# EAGLE board MainECU rev14 (EAGLE 9.6.2), part 1 of 2
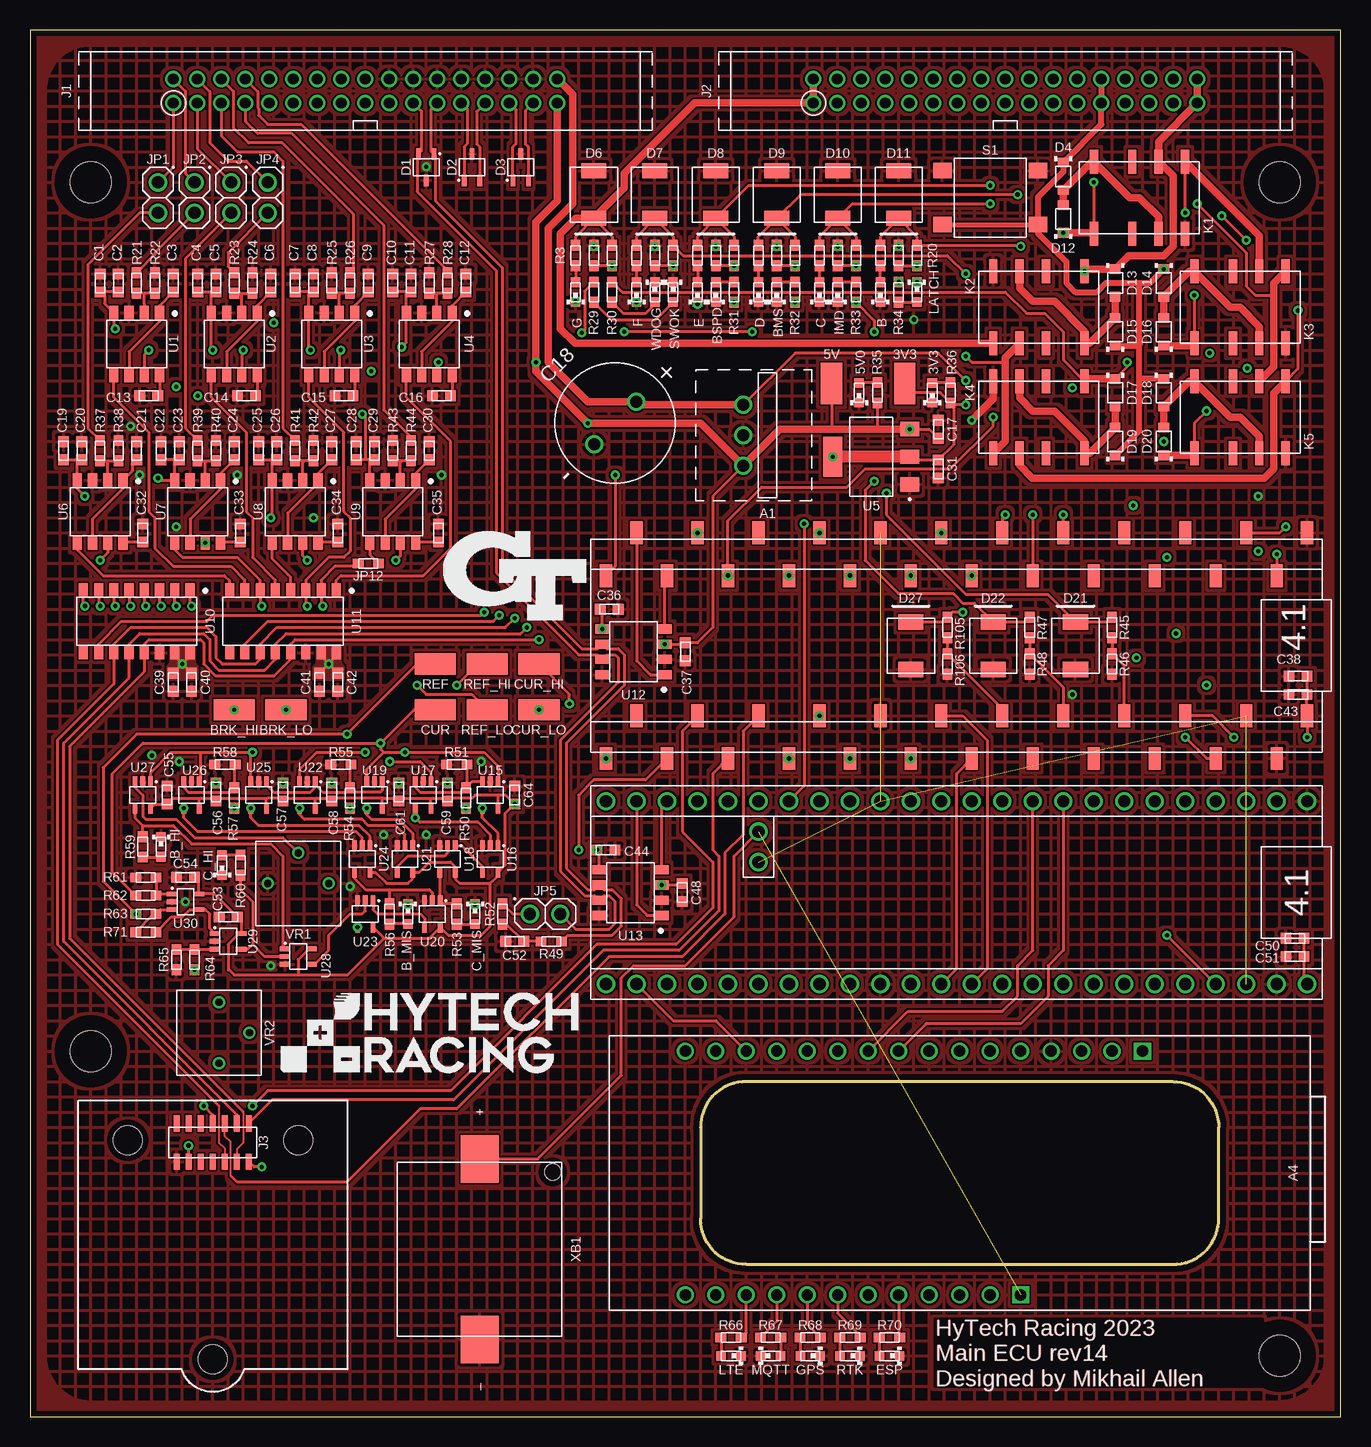
[diagram p8: board, top side]
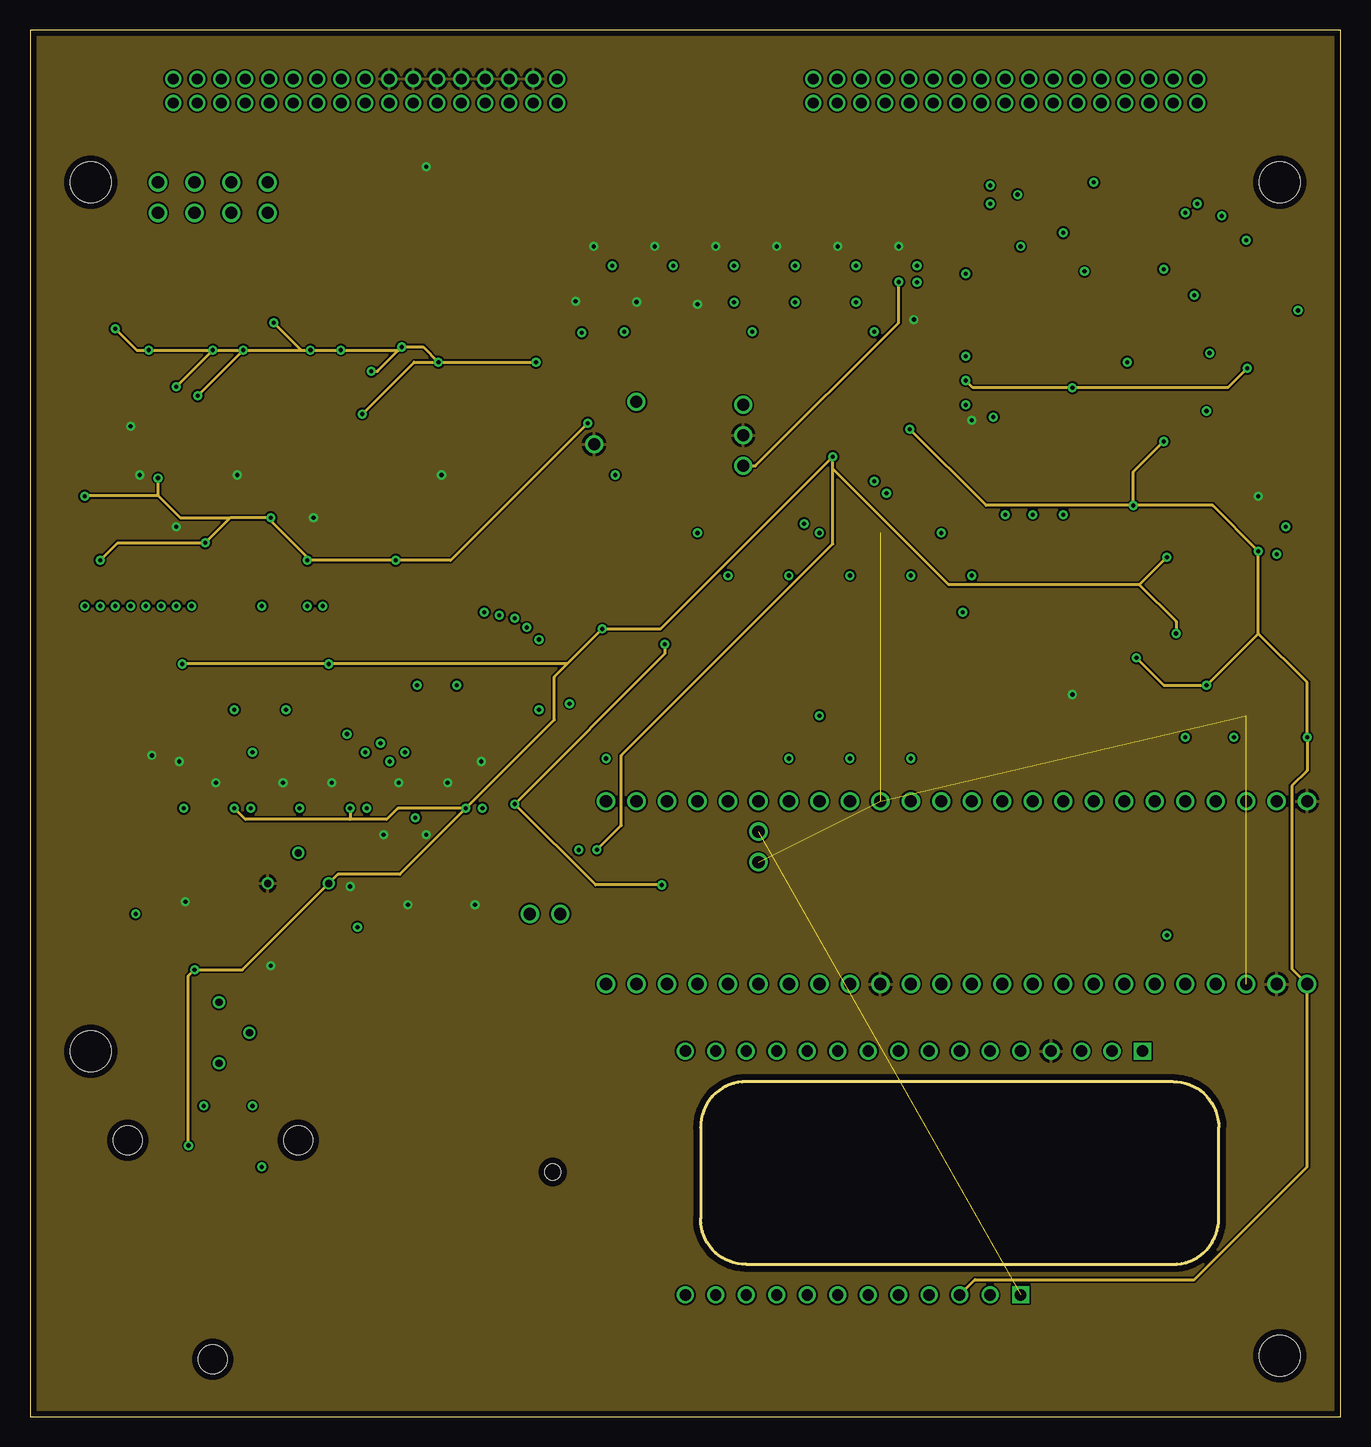
[diagram p9: board, inner layer Route2]
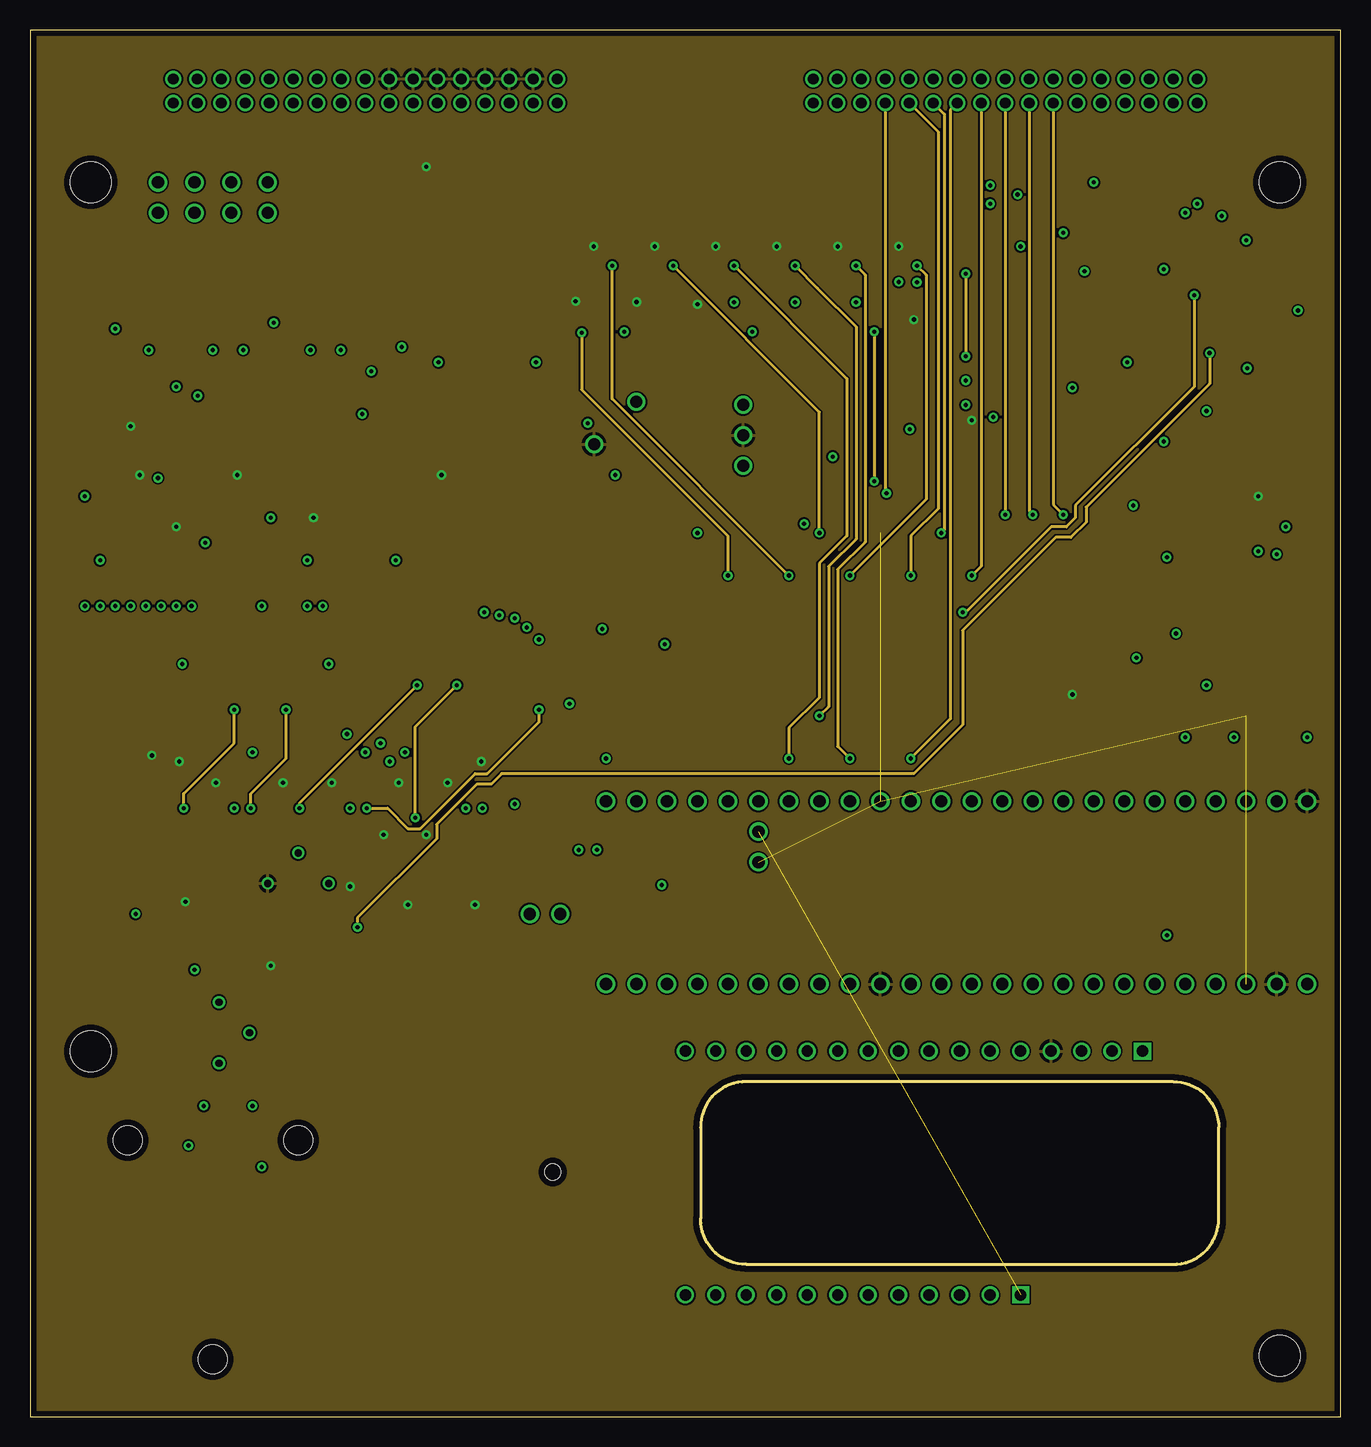
[diagram p10: board, inner layer Route15]
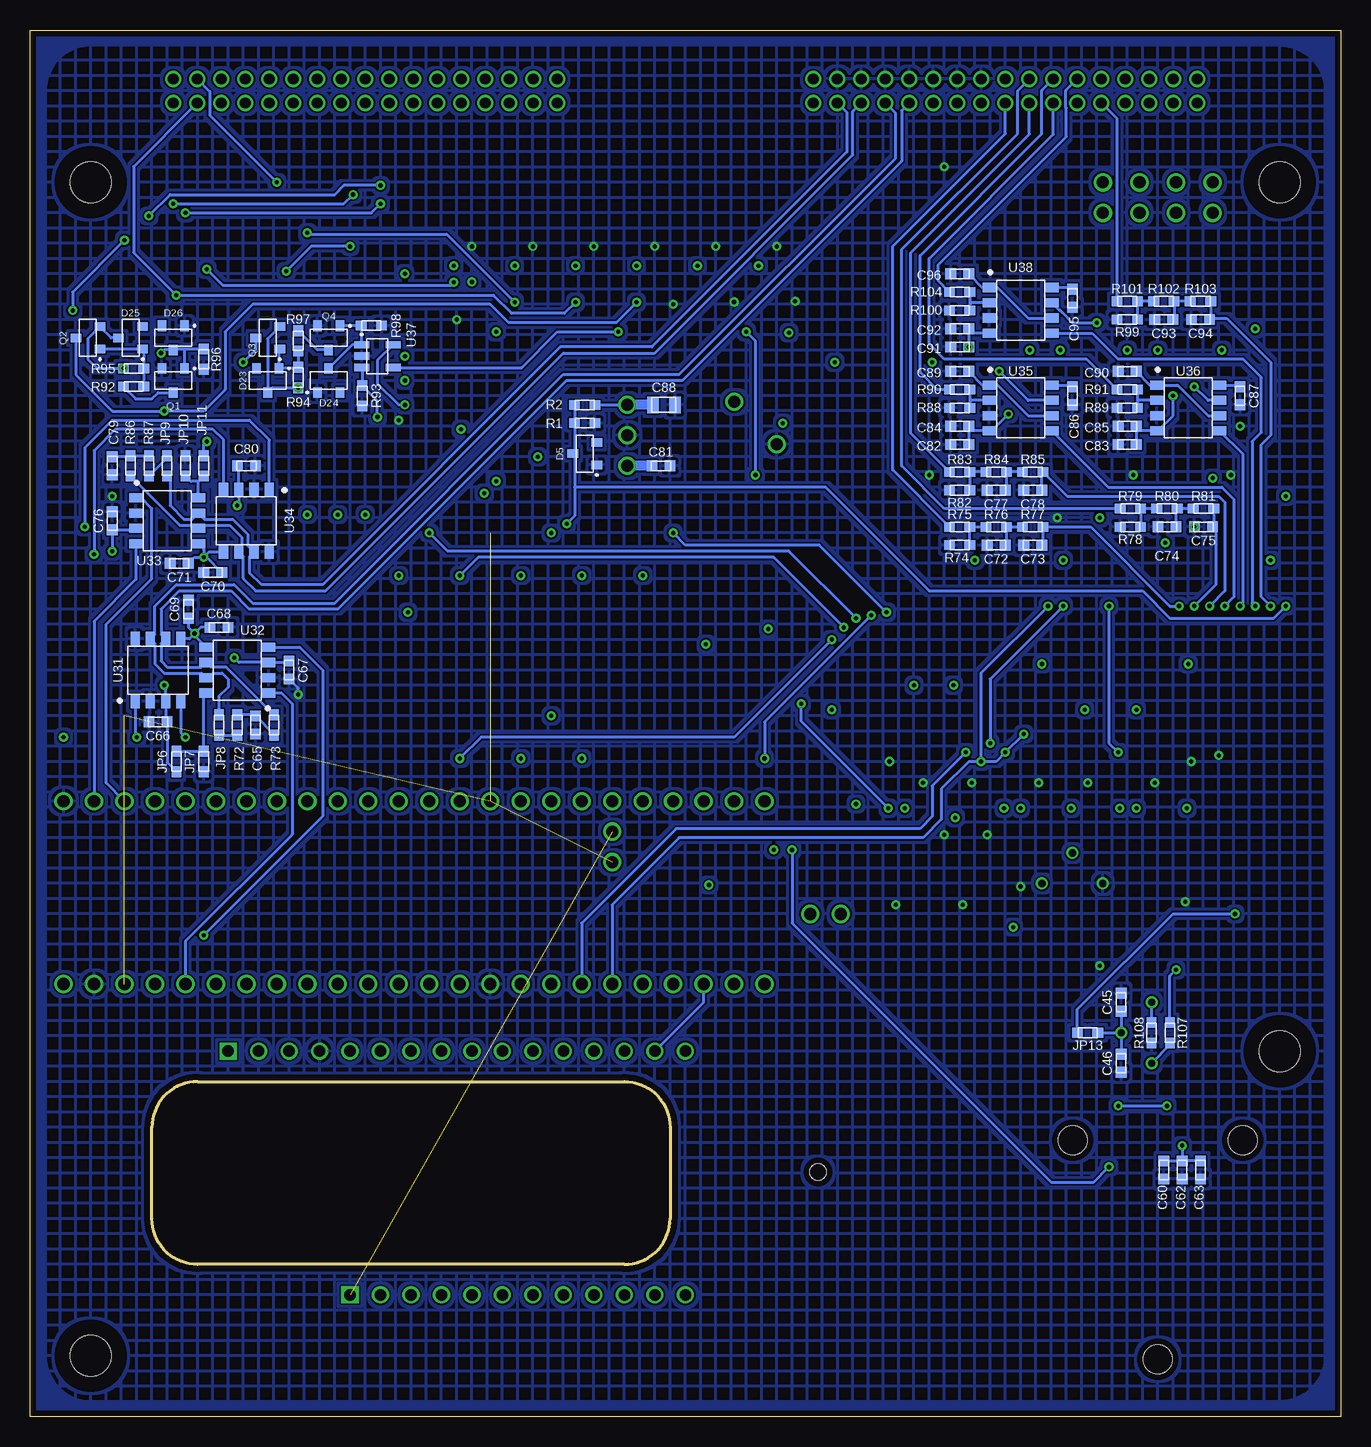
[diagram p11: board, bottom side, seen from below]

Size 109.22 x 115.57 mm. Coordinates in mm from the lower left corner, seen from the top.
Outline: 0,0 109.22,0 109.22,115.57 0,115.57 0,0
Outline: 55.88,24.13 55.88,16.51 arc90 59.69,12.7 95.25,12.7 arc90 99.06,16.51 99.06,24.13 arc90 95.25,27.94 59.69,27.94 arc90 55.88,24.13
Copper layers (1+2*15+16): Top 0.035mm / dielectric 0.2mm / Route2 0.0175mm / dielectric 1.065mm / Route15 0.0175mm / dielectric 0.2mm / Bottom 0.035mm
Design rules "HyTech Default (4 Layer)": minimum track width 6mil, minimum drill 10mil, track to track 6mil, track to pad 6mil, pad to pad 6mil, via to via 20mil, smd to smd 6mil, copper to edge 20mil, drill to drill 21mil, minimum pad ring 8mil, minimum via ring 8mil, stop-mask expansion 3mil, vias tented up to drill 30mil, thermal gap 10mil

## Footprints (pad centres in the part's own frame; a part is rotated, then mirrored left to right if it is on the bottom)
0603-LED = smd 0.8 x 0.8: 1 -0.825,0; 2 0.825,0
MOUNTING_M3 = hole 3.4: 0,0
OKI-78SR = drill 0.991: 1 -2.54,0; 2 0,0; 3 2.54,0
TEENSY_LONG_SSM = smd 1.905 x 1.02: 3.3V -5.842,-24.13; 3.3V@1 9.398,6.35; AGND/GND -9.398,-26.67; D0 5.842,-26.67; D1 9.398,-24.13; D2 5.842,-21.59; D3 9.398,-19.05; D4 5.842,-16.51; D5 9.398,-13.97; D6 5.842,-11.43; D7 9.398,-8.89; D8 5.842,-6.35; D9 9.398,-3.81; D10 5.842,-1.27; D11 9.398,1.27; D12 5.842,3.81; D13 -9.398,3.81; D14 -5.842,1.27; D15 -9.398,-1.27; D16 -5.842,-3.81; D17 -9.398,-6.35; D18 -5.842,-8.89; D19 -9.398,-11.43; D20 -5.842,-13.97; D21 -9.398,-16.51; D22 -5.842,-19.05; D23 -9.398,-21.59; D24 5.842,8.89; D25 9.398,11.43; D26 5.842,13.97; D27 9.398,16.51; D28 5.842,19.05; D29 9.398,21.59; D30 5.842,24.13; D31 9.398,26.67; D32 5.842,29.21; D33 -9.398,29.21; D34 -5.842,26.67; D35 -9.398,24.13; D36 -5.842,21.59; D37 -9.398,19.05; D38 -5.842,16.51; D39 -9.398,13.97; D40 -5.842,11.43; D41 -9.398,8.89; GND 9.398,-29.21; GND@1 -5.842,6.35; VIN -5.842,-29.21
TEENSY_LONG_EXT = drill 1.016: 3V3 0,5.08; 3V3@2 15.24,35.56; 3V3@3 10.16,45.72; AGND/GND 0,2.54; D0 15.24,2.54; D1 15.24,5.08; D2 15.24,7.62; D3 15.24,10.16; D4 15.24,12.7; D5 15.24,15.24; D6 15.24,17.78; D7 15.24,20.32; D8 15.24,22.86; D9 15.24,25.4; D10 15.24,27.94; D11 15.24,30.48; D12 15.24,33.02; D13 0,33.02; D14 0,30.48; D15 0,27.94; D16 0,25.4; D17 0,22.86; D18 0,20.32; D19 0,17.78; D20 0,15.24; D21 0,12.7; D22 0,10.16; D23 0,7.62; D24 15.24,38.1; D25 15.24,40.64; D26 15.24,43.18; D27 15.24,45.72; D28 15.24,48.26; D29 15.24,50.8; D30 15.24,53.34; D31 15.24,55.88; D32 15.24,58.42; D33 0,58.42; D34 0,55.88; D35 0,53.34; D36 0,50.8; D37 0,48.26; D38 0,45.72; D39 0,43.18; D40 0,40.64; D41 0,38.1; GND 15.24,0; GND@2 0,35.56; VBAT 12.7,45.72; VIN 0,0
NRF9160LTE = drill 0.95: 2 -10.16,46.99; 3 -10.16,44.45; 3V3 10.16,16.51; 4 -10.16,41.91; 5 -10.16,39.37; 6 -10.16,36.83; 7 -10.16,34.29; 8 -10.16,31.75; A0 10.16,24.13; A1 10.16,26.67; A2 10.16,29.21; A3 10.16,31.75; A4 10.16,34.29; A5 10.16,36.83; CIPO 10.16,44.45; COPI 10.16,41.91; EN -10.16,26.67; GND 10.16,21.59; MD 10.16,19.05; PS-EN 10.16,52.07; RX 10.16,46.99; SCK 10.16,39.37; SCL/1 -10.16,49.53; SDA/0 -10.16,52.07; TX 10.16,49.53; VUSB -10.16,29.21 | drill 0.95 square: RESET 10.16,13.97; VBAT -10.16,24.13
0603-CAP = smd 0.9 x 0.9: 1 -0.75,0; 2 0.75,0
EEH-AZS = drill 1: MINUS 2.5,0; PLUS -2.5,0
0805-CAP = smd 0.95 x 1.4: 1 -0.925,0; 2 0.925,0
SC-70-3 = smd 0.95 x 0.4: 1 -1.1,0.65; 2 -1.1,-0.65; 3 1.1,0
SOD-323 = smd 0.8 x 0.9: A -1.15,0; C 1.15,0
SOT-23 = smd 0.711 x 0.889: 1 -0.94,-1.003; 2 0.94,-1.003; 3 0,1.003
DO-214AA = smd 1.27 x 2.1: 1 -1.98,0; 2 1.98,0
EHT-117-01 = drill 0.9: 1 -16,-1; 2 -16,1; 3 -14,-1; 4 -14,1; 5 -12,-1; 6 -12,1; 7 -10,-1; 8 -10,1; 9 -8,-1; 10 -8,1; 11 -6,-1; 12 -6,1; 13 -4,-1; 14 -4,1; 15 -2,-1; 16 -2,1; 17 0,-1; 18 0,1; 19 2,-1; 20 2,1; 21 4,-1; 22 4,1; 23 6,-1; 24 6,1; 25 8,-1; 26 8,1; 27 10,-1; 28 10,1; 29 12,-1; 30 12,1; 31 14,-1; 32 14,1; 33 16,-1; 34 16,1
ADIS16460 = smd 0.5 x 1.37: 1 -3,1.6; 2 -3,-1.6; 3 -2,1.6; 4 -2,-1.6; 5 -1,1.6; 6 -1,-1.6; 7 0,1.6; 8 0,-1.6; 9 1,1.6; 10 1,-1.6; 11 2,1.6; 12 2,-1.6; 13 3,1.6; 14 3,-1.6 | hole 2.4: -7.1,-0.19; 7.1,-0.19; 0,18.06
1X02 = drill 1.016: 1 -1.27,0; 2 1.27,0
0603-RES = smd 0.9 x 0.8: 1 -0.85,0; 2 0.85,0
IM*G = smd 0.7 x 2: 1 -3.8,-3; 2 -0.6,-3; 3 1.6,-3; 4 3.8,-3; 5 3.8,3; 6 1.6,3; 7 -0.6,3; 8 -3.8,3
B3S-100X = smd 1.55 x 1.3: 1 3.975,-2.25; 2 -3.975,-2.25; 3 3.975,2.25; 4 -3.975,2.25
5015 = smd 3.429 x 1.778: 1 0,0
SOIC-08(NARROW,0.15") = smd 0.762 x 1.143: 1 -1.905,-2.603; 2 -0.635,-2.603; 3 0.635,-2.603; 4 1.905,-2.603; 5 1.905,2.603; 6 0.635,2.603; 7 -0.635,2.603; 8 -1.905,2.603
SOT-223 = smd 1.2 x 1.6: 1 -2.3,-3.2; 2 0,-3.2; 3 2.3,-3.2 | smd 3.3 x 1.6: 4 0,3.2
SOIC-16 = smd 0.762 x 1.143: 1 -4.445,-2.603; 2 -3.175,-2.603; 3 -1.905,-2.603; 4 -0.635,-2.603; 5 0.635,-2.603; 6 1.905,-2.603; 7 3.175,-2.603; 8 4.445,-2.603; 9 4.445,2.603; 10 3.175,2.603; 11 1.905,2.603; 12 0.635,2.603; 13 -0.635,2.603; 14 -1.905,2.603; 15 -3.175,2.603; 16 -4.445,2.603
SC-70-5 = smd 0.4 x 0.9: 1 -0.65,-1.1; 2 0,-1.1; 3 0.65,-1.1; 4 0.65,1.1; 5 -0.65,1.1
SOT-23-5 = smd 0.62 x 1.22: 1 -0.95,-1.31; 2 0,-1.31; 3 0.95,-1.31; 4 0.95,1.31; 5 -0.95,1.31
3362P = drill 0.6: 1 -2.54,0; 2 0,2.54; 3 2.54,0
498 = smd 3.962 x 3.175: 1 -7.518,0; 2 7.518,0 | hole 1.346: -6.426,6.096

## Placement (x,y rotation side)
3V3  LED_0603_YELLOW  [0603-LED]  75.18,85.34 90 top
5V0  LED_0603_YELLOW  [0603-LED]  69.09,85.34 90 top
$$U$1  [LOGO_GT_MEDIUM]  40.39,70.1 0 top
$$U$2  [MOUNTING_M3]  5.08,102.87 0 top
$$U$6  [MOUNTING_M3]  104.14,5.08 0 top
A1  VOLTAGE_REGULATOR_MODULE_OKI-78SR_5V  [OKI-78SR]  59.44,81.79 270 top
A2  TEENSY_4.1_SMT  [TEENSY_LONG_SSM]  77.22,64.26 90 top
A3  TEENSY_4.1  [TEENSY_LONG_EXT]  106.43,36.07 90 top
A4  NRF9160LTE  [NRF9160LTE]  106.68,20.32 90 top
B  LED_0603_GREEN  [0603-LED]  70.87,93.73 90 top
B_HI  LED_0603_RED  [0603-LED]  10.92,47.5 270 top
B_MIS  LED_0603_RED  [0603-LED]  31.5,41.91 270 top
BMS  LED_0603_ORANGE  [0603-LED]  62.23,93.73 90 top
BSPD  LED_0603_GREEN  [0603-LED]  57.15,93.73 90 top
C  LED_0603_GREEN  [0603-LED]  65.79,93.73 90 top
C1  CAPACITOR_0603_10V_0.1UF  [0603-CAP]  5.84,94.49 90 top
C2  CAPACITOR_0603_10V_1UF  [0603-CAP]  7.37,94.49 90 top
C3  CAPACITOR_0603_10V_0.1UF  [0603-CAP]  11.94,94.49 90 top
C4  CAPACITOR_0603_10V_0.1UF  [0603-CAP]  13.97,94.49 90 top
C5  CAPACITOR_0603_10V_1UF  [0603-CAP]  15.49,94.49 90 top
C6  CAPACITOR_0603_10V_0.1UF  [0603-CAP]  20.07,94.49 90 top
C7  CAPACITOR_0603_10V_0.1UF  [0603-CAP]  22.1,94.49 90 top
C8  CAPACITOR_0603_10V_1UF  [0603-CAP]  23.62,94.49 90 top
C9  CAPACITOR_0603_10V_0.1UF  [0603-CAP]  28.19,94.49 90 top
C10  CAPACITOR_0603_10V_0.1UF  [0603-CAP]  30.23,94.49 90 top
C11  CAPACITOR_0603_10V_1UF  [0603-CAP]  31.75,94.49 90 top
C12  CAPACITOR_0603_10V_0.1UF  [0603-CAP]  36.32,94.49 90 top
C13  CAPACITOR_0603_10V_10NF  [0603-CAP]  9.91,85.09 180 top
C14  CAPACITOR_0603_10V_10NF  [0603-CAP]  18.03,85.09 180 top
C15  CAPACITOR_0603_10V_10NF  [0603-CAP]  26.16,85.09 180 top
C16  CAPACITOR_0603_10V_10NF  [0603-CAP]  34.29,85.09 180 top
C17  CAPACITOR_0603_25V_10UF  [0603-CAP]  75.69,82.3 90 top
C18  CAPACITOR_ELECTROLYTIC_EEH_AZS_470UF  [EEH-AZS]  48.77,82.8 225 top
C19  CAPACITOR_0603_10V_0.1UF  [0603-CAP]  2.79,80.52 90 top
C20  CAPACITOR_0603_10V_1UF  [0603-CAP]  4.32,80.52 90 top
C21  CAPACITOR_0603_10V_0.1UF  [0603-CAP]  8.89,80.52 90 top
C22  CAPACITOR_0603_10V_0.1UF  [0603-CAP]  10.92,80.52 90 top
C23  CAPACITOR_0603_10V_1UF  [0603-CAP]  12.45,80.52 90 top
C24  CAPACITOR_0603_10V_0.1UF  [0603-CAP]  17.02,80.52 90 top
C25  CAPACITOR_0603_10V_0.1UF  [0603-CAP]  19.05,80.52 90 top
C26  CAPACITOR_0603_10V_1UF  [0603-CAP]  20.57,80.52 90 top
C27  CAPACITOR_0603_10V_0.1UF  [0603-CAP]  25.15,80.52 90 top
C28  CAPACITOR_0603_10V_0.1UF  [0603-CAP]  27.18,80.52 90 top
C29  CAPACITOR_0603_10V_1UF  [0603-CAP]  28.7,80.52 90 top
C30  CAPACITOR_0603_10V_0.1UF  [0603-CAP]  33.27,80.52 90 top
C31  CAPACITOR_0603_25V_10UF  [0603-CAP]  75.69,78.99 270 top
C32  CAPACITOR_0603_10V_10NF  [0603-CAP]  9.4,73.66 90 top
C33  CAPACITOR_0603_10V_10NF  [0603-CAP]  17.53,73.66 90 top
C34  CAPACITOR_0603_10V_10NF  [0603-CAP]  25.65,73.66 90 top
C35  CAPACITOR_0603_10V_10NF  [0603-CAP]  34.04,73.66 90 top
C36  CAPACITOR_0603_10V_0.1UF  [0603-CAP]  48.26,67.31 0 top
C37  CAPACITOR_0603_10V_0.1UF  [0603-CAP]  54.61,63.75 270 top
C38  CAPACITOR_0603_10V_0.1UF  [0603-CAP]  105.66,61.72 180 top
C39  CAPACITOR_0603_10V_1UF  [0603-CAP]  11.94,61.21 270 top
C40  CAPACITOR_0603_10V_0.1UF  [0603-CAP]  13.46,61.21 270 top
C41  CAPACITOR_0603_10V_1UF  [0603-CAP]  24.13,61.21 270 top
C42  CAPACITOR_0603_10V_0.1UF  [0603-CAP]  25.65,61.21 270 top
C43  CAPACITOR_0603_10V_1UF  [0603-CAP]  105.66,60.2 180 top
C44  CAPACITOR_0603_10V_0.1UF  [0603-CAP]  48.01,47.24 0 top
C45  CAPACITOR_0603_10V_0.1UF  [0603-CAP]  18.29,34.54 90 bottom
C46  CAPACITOR_0603_10V_1UF  [0603-CAP]  18.29,29.46 270 bottom
C48  CAPACITOR_0603_10V_0.1UF  [0603-CAP]  54.36,43.69 270 top
C50  CAPACITOR_0603_10V_0.1UF  [0603-CAP]  105.41,39.88 180 top
C51  CAPACITOR_0603_10V_1UF  [0603-CAP]  105.41,38.35 180 top
C52  CAPACITOR_0603_10V_4.7NF  [0603-CAP]  40.39,39.62 180 top
C53  CAPACITOR_0603_10V_0.1UF  [0603-CAP]  16.51,41.66 180 top
C54  CAPACITOR_0603_10V_0.1UF  [0603-CAP]  12.95,44.96 180 top
C55  CAPACITOR_0603_10V_0.1UF  [0603-CAP]  11.43,51.82 90 top
C56  CAPACITOR_0603_10V_0.1UF  [0603-CAP]  15.49,52.07 90 top
C57  CAPACITOR_0603_10V_0.1UF  [0603-CAP]  21.08,52.07 90 top
C58  CAPACITOR_0603_10V_0.1UF  [0603-CAP]  25.15,52.07 90 top
C59  CAPACITOR_0603_10V_0.1UF  [0603-CAP]  34.8,52.07 90 top
C60  CAPACITOR_0603_25V_0.1UF  [0603-CAP]  14.73,20.57 270 bottom
C61  CAPACITOR_0603_10V_0.1UF  [0603-CAP]  30.73,52.07 90 top
C62  CAPACITOR_0603_25V_1UF  [0603-CAP]  13.21,20.57 270 bottom
C63  CAPACITOR_0603_25V_10UF  [0603-CAP]  11.68,20.57 270 bottom
C64  CAPACITOR_0603_10V_0.1UF  [0603-CAP]  40.39,51.82 90 top
C65  CAPACITOR_0603_10V_4.7NF  [0603-CAP]  90.42,57.66 270 bottom
C66  CAPACITOR_0603_10V_0.1UF  [0603-CAP]  98.55,57.91 180 bottom
C67  CAPACITOR_0603_10V_0.1UF  [0603-CAP]  87.63,62.23 270 bottom
C68  CAPACITOR_0603_10V_0.1UF  [0603-CAP]  93.47,65.79 0 bottom
C69  CAPACITOR_0603_10V_0.1UF  [0603-CAP]  96.01,67.31 90 bottom
C70  CAPACITOR_0603_10V_0.1UF  [0603-CAP]  93.98,70.36 180 bottom
C71  CAPACITOR_0603_10V_0.1UF  [0603-CAP]  96.77,71.12 180 bottom
C72  CAPACITOR_0603_10V_0.1UF  [0603-CAP]  28.7,72.64 180 bottom
C73  CAPACITOR_0603_10V_0.1UF  [0603-CAP]  25.65,72.64 180 bottom
C74  CAPACITOR_0603_10V_0.1UF  [0603-CAP]  14.48,74.17 180 bottom
C75  CAPACITOR_0603_10V_0.1UF  [0603-CAP]  11.43,74.17 180 bottom
C76  CAPACITOR_0603_10V_0.1UF  [0603-CAP]  102.36,74.68 90 bottom
C77  CAPACITOR_0603_10V_0.1UF  [0603-CAP]  28.7,77.22 180 bottom
C78  CAPACITOR_0603_10V_0.1UF  [0603-CAP]  25.65,77.22 180 bottom
C79  CAPACITOR_0603_10V_4.7NF  [0603-CAP]  102.36,79.25 270 bottom
C80  CAPACITOR_0603_10V_0.1UF  [0603-CAP]  91.19,79.25 0 bottom
C81  CAPACITOR_0603_25V_10UF  [0603-CAP]  56.64,79.25 0 bottom
C82  CAPACITOR_0603_10V_0.1UF  [0603-CAP]  31.75,81.03 180 bottom
C83  CAPACITOR_0603_10V_0.1UF  [0603-CAP]  17.78,81.03 180 bottom
C84  CAPACITOR_0603_10V_1UF  [0603-CAP]  31.75,82.55 180 bottom
C85  CAPACITOR_0603_10V_1UF  [0603-CAP]  17.78,82.55 180 bottom
C86  CAPACITOR_0603_10V_10NF  [0603-CAP]  22.35,85.09 270 bottom
C87  CAPACITOR_0603_10V_10NF  [0603-CAP]  8.38,85.09 270 bottom
C88  CAPACITOR_0805_50V_10UF  [0805-CAP]  56.39,84.33 0 bottom
C89  CAPACITOR_0603_10V_0.1UF  [0603-CAP]  31.75,87.12 180 bottom
C90  CAPACITOR_0603_10V_0.1UF  [0603-CAP]  17.78,87.12 180 bottom
C91  CAPACITOR_0603_10V_0.1UF  [0603-CAP]  31.75,89.15 180 bottom
C92  CAPACITOR_0603_10V_1UF  [0603-CAP]  31.75,90.68 180 bottom
C93  CAPACITOR_0603_10V_0.1UF  [0603-CAP]  14.73,91.44 180 bottom
C94  CAPACITOR_0603_10V_0.1UF  [0603-CAP]  11.68,91.44 180 bottom
C95  CAPACITOR_0603_10V_10NF  [0603-CAP]  22.35,93.22 270 bottom
C96  CAPACITOR_0603_10V_0.1UF  [0603-CAP]  31.75,95.25 180 bottom
C_HI  LED_0603_RED  [0603-LED]  16,45.97 90 top
C_MIS  LED_0603_RED  [0603-LED]  37.08,41.91 270 top
D  LED_0603_GREEN  [0603-LED]  60.71,93.73 90 top
D1  TVS_BIDIRECTIONAL_DUAL  [SC-70-3]  33.02,104.14 270 top
D2  TVS_BIDIRECTIONAL_DUAL  [SC-70-3]  36.83,104.14 90 top
D3  TVS_BIDIRECTIONAL_DUAL  [SC-70-3]  40.89,104.14 90 top
D4  SCHOTTKY_SOD323_30V  [SOD-323]  86.11,103.38 90 top
D5  TVS__5V  [SOT-23]  62.99,80.26 90 bottom
D6  TVS_DO-214AA_28V  [DO-214AA]  46.99,101.85 270 top
D7  TVS_DO-214AA_28V  [DO-214AA]  52.07,101.85 270 top
D8  TVS_DO-214AA_28V  [DO-214AA]  57.15,101.85 270 top
D9  TVS_DO-214AA_28V  [DO-214AA]  62.23,101.85 270 top
D10  TVS_DO-214AA_28V  [DO-214AA]  67.31,101.85 270 top
D11  TVS_DO-214AA_28V  [DO-214AA]  72.39,101.85 270 top
D12  SCHOTTKY_SOD323_30V  [SOD-323]  86.11,99.82 270 top
D13  SCHOTTKY_SOD323_30V  [SOD-323]  90.42,94.49 90 top
D14  SCHOTTKY_SOD323_30V  [SOD-323]  94.49,94.49 90 top
D15  SCHOTTKY_SOD323_30V  [SOD-323]  90.42,90.42 270 top
D16  SCHOTTKY_SOD323_30V  [SOD-323]  94.49,90.42 270 top
D17  SCHOTTKY_SOD323_30V  [SOD-323]  90.42,85.34 90 top
D18  SCHOTTKY_SOD323_30V  [SOD-323]  94.49,85.34 90 top
D19  SCHOTTKY_SOD323_30V  [SOD-323]  90.42,81.28 270 top
D20  SCHOTTKY_SOD323_30V  [SOD-323]  94.49,81.28 270 top
D21  TVS_DO-214AA_28V  [DO-214AA]  87.12,64.26 90 top
D22  TVS_DO-214AA_28V  [DO-214AA]  80.26,64.26 90 top
D23  TVS__15V  [SOT-23]  89.41,86.36 180 bottom
D24  TVS__15V  [SOT-23]  84.33,86.36 0 bottom
D25  TVS__15V  [SOT-23]  100.84,89.92 90 bottom
D26  TVS__15V  [SOT-23]  97.28,89.92 180 bottom
D27  TVS_DO-214AA_28V  [DO-214AA]  73.41,64.26 90 top
E  LED_0603_GREEN  [0603-LED]  55.63,93.73 90 top
ESP  LED_0603_RED  [0603-LED]  71.63,5.08 180 top
F  LED_0603_GREEN  [0603-LED]  50.55,93.73 90 top
G  LED_0603_GREEN  [0603-LED]  45.47,93.73 90 top
GPS  LED_0603_RED  [0603-LED]  65.02,5.08 180 top
IMD  LED_0603_ORANGE  [0603-LED]  67.31,93.73 90 top
J1  CONNECTOR-34__  [EHT-117-01]  27.94,110.49 0 top
J2  CONNECTOR-34__  [EHT-117-01]  81.28,110.49 0 top
J3  ADIS16460  [ADIS16460]  15.24,22.86 180 top
JP1  JUMPER__1X02  [1X02]  10.67,101.6 270 top
JP2  JUMPER__1X02  [1X02]  13.72,101.6 270 top
JP3  JUMPER__1X02  [1X02]  16.76,101.6 270 top
JP4  JUMPER__1X02  [1X02]  19.81,101.6 270 top
JP5  JUMPER__1X02  [1X02]  42.93,41.91 0 top
JP6  JUMPER_0603_  [0603-RES]  97.03,54.61 270 bottom
JP7  DNP  [0603-RES]  94.74,54.61 90 bottom
JP8  JUMPER_0603_  [0603-RES]  93.47,57.66 90 bottom
JP9  JUMPER_0603_  [0603-RES]  97.79,79.25 270 bottom
JP10  DNP  [0603-RES]  96.27,79.25 270 bottom
JP11  JUMPER_0603_  [0603-RES]  94.74,79.25 90 bottom
JP12  JUMPER_0603_  [0603-RES]  28.19,71.12 0 top
JP13  DNP  [0603-RES]  21.08,32 180 bottom
K1  RELAY_DPDT_07DSMT  [IM*G]  92.46,101.6 0 top
K2  RELAY_DPDT_07DSMT  [IM*G]  84.07,92.46 180 top
K3  RELAY_DPDT_07DSMT  [IM*G]  100.84,92.46 0 top
K4  RELAY_DPDT_07DSMT  [IM*G]  84.07,83.31 180 top
K5  RELAY_DPDT_07DSMT  [IM*G]  100.84,83.31 0 top
LATCH  LED_0603_WHITE  [0603-LED]  73.91,93.73 270 top
LTE  LED_0603_RED  [0603-LED]  58.42,5.08 180 top
MQTT  LED_0603_RED  [0603-LED]  61.72,5.08 0 top
Q1  TRANSISTOR_N_MOS__DMG3406L-7  [SOT-23]  97.28,86.36 180 bottom
Q2  TRANSISTOR_P_MOS_SOT-23_DMP3056L-7  [SOT-23]  104.39,89.92 90 bottom
Q3  TRANSISTOR_P_MOS_SOT-23_DMP3056L-7  [SOT-23]  89.41,89.92 90 bottom
Q4  TRANSISTOR_N_MOS__DMG3406L-7  [SOT-23]  84.33,89.92 180 bottom
R1  RESISTOR_0603_1.24K  [0603-RES]  62.99,82.8 180 bottom
R2  RESISTOR_0603_10K  [0603-RES]  62.99,84.33 0 bottom
R3  RESISTOR_0603_2K  [0603-RES]  45.47,96.77 270 top
R4  RESISTOR_0603_4.64K  [0603-RES]  46.99,96.77 270 top
R5  RESISTOR_0603_36.5K  [0603-RES]  48.51,96.77 90 top
R6  RESISTOR_0603_2K  [0603-RES]  50.55,96.77 270 top
R7  RESISTOR_0603_4.64K  [0603-RES]  52.07,96.77 270 top
R8  RESISTOR_0603_36.5K  [0603-RES]  53.59,96.77 90 top
R9  RESISTOR_0603_2K  [0603-RES]  55.63,96.77 270 top
R10  RESISTOR_0603_4.64K  [0603-RES]  57.15,96.77 270 top
R11  RESISTOR_0603_36.5K  [0603-RES]  58.67,96.77 90 top
R12  RESISTOR_0603_2K  [0603-RES]  60.71,96.77 270 top
R13  RESISTOR_0603_4.64K  [0603-RES]  62.23,96.77 270 top
R14  RESISTOR_0603_36.5K  [0603-RES]  63.75,96.77 90 top
R15  RESISTOR_0603_2K  [0603-RES]  65.79,96.77 270 top
R16  RESISTOR_0603_4.64K  [0603-RES]  67.31,96.77 270 top
R17  RESISTOR_0603_36.5K  [0603-RES]  68.83,96.77 90 top
R18  RESISTOR_0603_2K  [0603-RES]  70.87,96.77 270 top
R19  RESISTOR_0603_4.64K  [0603-RES]  72.39,96.77 270 top
R20  RESISTOR_0603_36.5K  [0603-RES]  73.91,96.77 90 top
R21  RESISTOR_0603_10K  [0603-RES]  8.89,94.49 270 top
R22  RESISTOR_0603_15K  [0603-RES]  10.41,94.49 270 top
R23  RESISTOR_0603_10K  [0603-RES]  17.02,94.49 270 top
R24  RESISTOR_0603_15K  [0603-RES]  18.54,94.49 270 top
R25  RESISTOR_0603_1.24K  [0603-RES]  25.15,94.49 270 top
R26  RESISTOR_0603_10K  [0603-RES]  26.67,94.49 90 top
R27  RESISTOR_0603_1.24K  [0603-RES]  33.27,94.49 270 top
R28  RESISTOR_0603_10K  [0603-RES]  34.8,94.49 90 top
R29  RESISTOR_0603_120  [0603-RES]  46.99,93.73 270 top
R30  RESISTOR_0603_2K  [0603-RES]  48.51,93.73 270 top
R31  RESISTOR_0603_2K  [0603-RES]  58.67,93.73 90 top
R32  RESISTOR_0603_2K  [0603-RES]  63.75,93.73 90 top
R33  RESISTOR_0603_2K  [0603-RES]  68.83,93.73 90 top
R34  RESISTOR_0603_180  [0603-RES]  72.39,93.73 90 top
R35  RESISTOR_0603_240  [0603-RES]  70.61,85.34 90 top
R36  RESISTOR_0603_120  [0603-RES]  76.71,85.34 90 top
R37  RESISTOR_0603_10K  [0603-RES]  5.84,80.52 270 top
R38  RESISTOR_0603_15K  [0603-RES]  7.37,80.52 270 top
R39  RESISTOR_0603_10K  [0603-RES]  13.97,80.52 270 top
R40  RESISTOR_0603_15K  [0603-RES]  15.49,80.52 270 top
R41  RESISTOR_0603_10K  [0603-RES]  22.1,80.52 270 top
R42  RESISTOR_0603_15K  [0603-RES]  23.62,80.52 270 top
R43  RESISTOR_0603_1.24K  [0603-RES]  30.23,80.52 270 top
R44  RESISTOR_0603_10K  [0603-RES]  31.75,80.52 90 top
R45  RESISTOR_0603_36.5K  [0603-RES]  90.17,65.79 90 top
R46  RESISTOR_0603_4.64K  [0603-RES]  90.17,62.74 90 top
R47  RESISTOR_0603_36.5K  [0603-RES]  83.31,65.79 90 top
R48  RESISTOR_0603_4.64K  [0603-RES]  83.31,62.74 90 top
R49  RESISTOR_0603_60.4  [0603-RES]  43.43,39.62 180 top
R50  RESISTOR_0603_1.13K  [0603-RES]  36.32,51.56 270 top
R51  RESISTOR_0603_10.2K  [0603-RES]  35.56,54.36 0 top
R52  RESISTOR_0603_60.4  [0603-RES]  39.37,41.91 90 top
R53  RESISTOR_0603_240  [0603-RES]  35.56,41.91 270 top
R54  RESISTOR_0603_10.2K  [0603-RES]  26.67,51.56 270 top
R55  RESISTOR_0603_1.13K  [0603-RES]  25.91,54.36 0 top
R56  RESISTOR_0603_240  [0603-RES]  29.97,41.91 270 top
R57  RESISTOR_0603_1.13K  [0603-RES]  17.02,51.56 270 top
R58  RESISTOR_0603_10.2K  [0603-RES]  16.26,54.36 0 top
R59  RESISTOR_0603_240  [0603-RES]  9.4,47.5 270 top
R60  RESISTOR_0603_240  [0603-RES]  17.53,45.97 90 top
R61  RESISTOR_0603_43K  [0603-RES]  9.65,44.96 180 top
R62  RESISTOR_0603_1K  [0603-RES]  9.65,43.43 0 top
R63  RESISTOR_0603_1K  [0603-RES]  9.65,41.91 0 top
R64  RESISTOR_0603_14K  [0603-RES]  13.72,38.1 270 top
R65  RESISTOR_0603_10K  [0603-RES]  12.19,38.1 90 top
R66  RESISTOR_0603_2K  [0603-RES]  58.42,6.6 180 top
R67  RESISTOR_0603_2K  [0603-RES]  61.72,6.6 0 top
R68  RESISTOR_0603_2K  [0603-RES]  65.02,6.6 180 top
R69  RESISTOR_0603_2K  [0603-RES]  68.33,6.6 180 top
R70  RESISTOR_0603_2K  [0603-RES]  71.63,6.6 180 top
R71  RESISTOR_0603_43K  [0603-RES]  9.65,40.39 0 top
R72  RESISTOR_0603_60.4  [0603-RES]  91.95,57.66 270 bottom
R73  RESISTOR_0603_60.4  [0603-RES]  88.9,57.66 270 bottom
R74  RESISTOR_0603_1.24K  [0603-RES]  31.75,72.64 0 bottom
R75  RESISTOR_0603_10K  [0603-RES]  31.75,74.17 0 bottom
R76  RESISTOR_0603_10K  [0603-RES]  28.7,74.17 180 bottom
R77  RESISTOR_0603_10K  [0603-RES]  25.65,74.17 180 bottom
R78  RESISTOR_0603_1.24K  [0603-RES]  17.53,74.17 0 bottom
R79  RESISTOR_0603_10K  [0603-RES]  17.53,75.69 0 bottom
R80  RESISTOR_0603_10K  [0603-RES]  14.48,75.69 180 bottom
R81  RESISTOR_0603_10K  [0603-RES]  11.43,75.69 180 bottom
R82  RESISTOR_0603_1.24K  [0603-RES]  31.75,77.22 0 bottom
R83  RESISTOR_0603_10K  [0603-RES]  31.75,78.74 0 bottom
R84  RESISTOR_0603_10K  [0603-RES]  28.7,78.74 180 bottom
R85  RESISTOR_0603_10K  [0603-RES]  25.65,78.74 180 bottom
R86  RESISTOR_0603_60.4  [0603-RES]  100.84,79.25 90 bottom
R87  RESISTOR_0603_60.4  [0603-RES]  99.31,79.25 270 bottom
R88  RESISTOR_0603_1.24K  [0603-RES]  31.75,84.07 0 bottom
R89  RESISTOR_0603_1.24K  [0603-RES]  17.78,84.07 0 bottom
R90  RESISTOR_0603_10K  [0603-RES]  31.75,85.6 180 bottom
R91  RESISTOR_0603_10K  [0603-RES]  17.78,85.6 180 bottom
R92  RESISTOR_0603_5.1K  [0603-RES]  100.58,85.85 0 bottom
R93  RESISTOR_0603_10K  [0603-RES]  81.53,85.09 90 bottom
R94  RESISTOR_0603_5.1K  [0603-RES]  86.87,86.61 270 bottom
R95  RESISTOR_0603_5.1K  [0603-RES]  100.58,87.38 180 bottom
R96  RESISTOR_0603_10K  [0603-RES]  94.74,88.14 90 bottom
R97  RESISTOR_0603_5.1K  [0603-RES]  86.87,89.66 270 bottom
R98  RESISTOR_0603_10K  [0603-RES]  80.77,90.93 180 bottom
R99  RESISTOR_0603_1.24K  [0603-RES]  17.78,91.44 0 bottom
R100  RESISTOR_0603_1.24K  [0603-RES]  31.75,92.2 0 bottom
R101  RESISTOR_0603_10K  [0603-RES]  17.78,92.96 0 bottom
R102  RESISTOR_0603_10K  [0603-RES]  14.73,92.96 180 bottom
R103  RESISTOR_0603_10K  [0603-RES]  11.68,92.96 180 bottom
R104  RESISTOR_0603_10K  [0603-RES]  31.75,93.73 180 bottom
R105  RESISTOR_0603_36.5K  [0603-RES]  76.45,65.79 90 top
R106  RESISTOR_0603_4.64K  [0603-RES]  76.45,62.74 90 top
R107  RESISTOR_0603_10K  [0603-RES]  14.22,32 90 bottom
R108  RESISTOR_0603_10K  [0603-RES]  15.75,32 90 bottom
RTK  LED_0603_RED  [0603-LED]  68.33,5.08 180 top
S1  BUTTON  [B3S-100X]  80.01,101.6 0 top
SWOK  LED_0603_ORANGE  [0603-LED]  53.59,93.73 270 top
TP1  TEST_POINT  [5015]  66.8,86.11 270 top
TP2  TEST_POINT  [5015]  72.9,86.11 270 top
TP3  TEST_POINT  [5015]  42.42,58.93 180 top
TP4  TEST_POINT  [5015]  42.42,62.74 180 top
TP5  TEST_POINT  [5015]  38.1,58.93 180 top
TP6  TEST_POINT  [5015]  38.1,62.74 180 top
TP7  TEST_POINT  [5015]  21.34,58.93 180 top
TP8  TEST_POINT  [5015]  17.02,58.93 180 top
TP9  TEST_POINT  [5015]  33.78,58.93 0 top
TP10  TEST_POINT  [5015]  33.78,62.74 0 top
U1  MAX7400  [SOIC-08(NARROW,0.15")]  8.89,89.41 180 top
U2  MAX7400  [SOIC-08(NARROW,0.15")]  17.02,89.41 180 top
U3  MAX7400  [SOIC-08(NARROW,0.15")]  25.15,89.41 180 top
U4  MAX7400  [SOIC-08(NARROW,0.15")]  33.27,89.41 180 top
U5  VOLTAGE_REGULATOR_SOT-223_3.3V  [SOT-223]  70.1,80.01 90 top
U6  MAX7400  [SOIC-08(NARROW,0.15")]  5.84,75.44 180 top
U7  MAX7400  [SOIC-08(NARROW,0.15")]  13.97,75.44 180 top
U8  MAX7400  [SOIC-08(NARROW,0.15")]  22.1,75.44 180 top
U9  MAX7400  [SOIC-08(NARROW,0.15")]  30.23,75.44 180 top
U10  MCP3208  [SOIC-16]  8.89,66.29 180 top
U11  MCP3208  [SOIC-16]  21.08,66.29 180 top
U12  TCAN1051HQV-Q1  [SOIC-08(NARROW,0.15")]  50.29,63.75 90 top
U13  TCAN1051HQV-Q1  [SOIC-08(NARROW,0.15")]  50.04,43.69 90 top
U15  OPAMP_1_CHANNEL_OPA991  [SC-70-5]  38.35,51.82 180 top
U16  LOGICGATE_OR  [SC-70-5]  38.35,46.48 180 top
U17  OPAMP_1_CHANNEL_OPA991  [SC-70-5]  32.77,51.82 180 top
U18  LOGICGATE_OR  [SC-70-5]  34.8,46.48 180 top
U19  OPAMP_1_CHANNEL_OPA991  [SC-70-5]  28.7,51.82 180 top
U20  LOGICGATE_OR  [SC-70-5]  33.53,41.91 180 top
U21  LOGICGATE_OR  [SC-70-5]  31.24,46.48 180 top
U22  OPAMP_1_CHANNEL_OPA991  [SC-70-5]  23.11,51.82 180 top
U23  LOGICGATE_NOR  [SC-70-5]  27.94,41.91 180 top
U24  LOGICGATE_OR  [SC-70-5]  27.69,46.48 180 top
U25  OPAMP_1_CHANNEL_OPA991  [SC-70-5]  19.05,51.82 180 top
U26  OPAMP_1_CHANNEL_OPA991  [SC-70-5]  13.46,51.82 180 top
U27  OPAMP_1_CHANNEL_OPA991  [SC-70-5]  9.4,51.82 180 top
U28  LOGICGATE_AND_DCK3  [SC-70-5]  22.35,38.35 270 top
U29  OPAMP_1_CHANNEL_OPA991  [SC-70-5]  16.51,39.62 270 top
U30  OPAMP_1_CHANNEL_OPA991  [SC-70-5]  12.95,42.93 270 top
U31  TCAN1051HQV-Q1  [SOIC-08(NARROW,0.15")]  98.55,62.23 0 bottom
U32  TCAN1051HQV-Q1  [SOIC-08(NARROW,0.15")]  91.95,62.23 90 bottom
U33  TCAN1051HQV-Q1  [SOIC-08(NARROW,0.15")]  97.79,74.68 270 bottom
U34  TCAN1051HQV-Q1  [SOIC-08(NARROW,0.15")]  91.19,74.68 180 bottom
U35  MAX7400  [SOIC-08(NARROW,0.15")]  26.67,84.07 270 bottom
U36  MAX7400  [SOIC-08(NARROW,0.15")]  12.7,84.07 270 bottom
U37  ADM8316WBX30  [SOT-23-5]  80.26,88.39 270 bottom
U38  MAX7400  [SOIC-08(NARROW,0.15")]  26.67,92.2 270 bottom
U$3  [MOUNTING_M3]  104.14,102.87 0 top
U$5  [MOUNTING_M3]  5.08,30.48 0 top
U$6  [LOGO_HYTECH_MEDIUM]  20.83,28.7 0 top
VR1  RESISTOR_TRIMPOT_10K_3362P  [3362P]  22.35,44.45 0 top
VR2  RESISTOR_TRIMPOT_10K_3362P  [3362P]  15.75,32 270 top
WDOG  LED_0603_ORANGE  [0603-LED]  52.07,93.73 270 top
XB1  BATTERY_HOLDER_KEYSTONE_498  [498]  37.47,13.97 270 top